# Altium schematic sheet 2008_SablierElectronique_MosfetConnections.SchDoc
size A3; Author: Carlos Reyes Peña; Organization: ETML-ES; Address1: Avenue Recordon 1; Address2: 1004 Lausanne; Address3: Switzerland; Revision: 1; SheetNumber: 3; SheetTotal: 4; Version: A
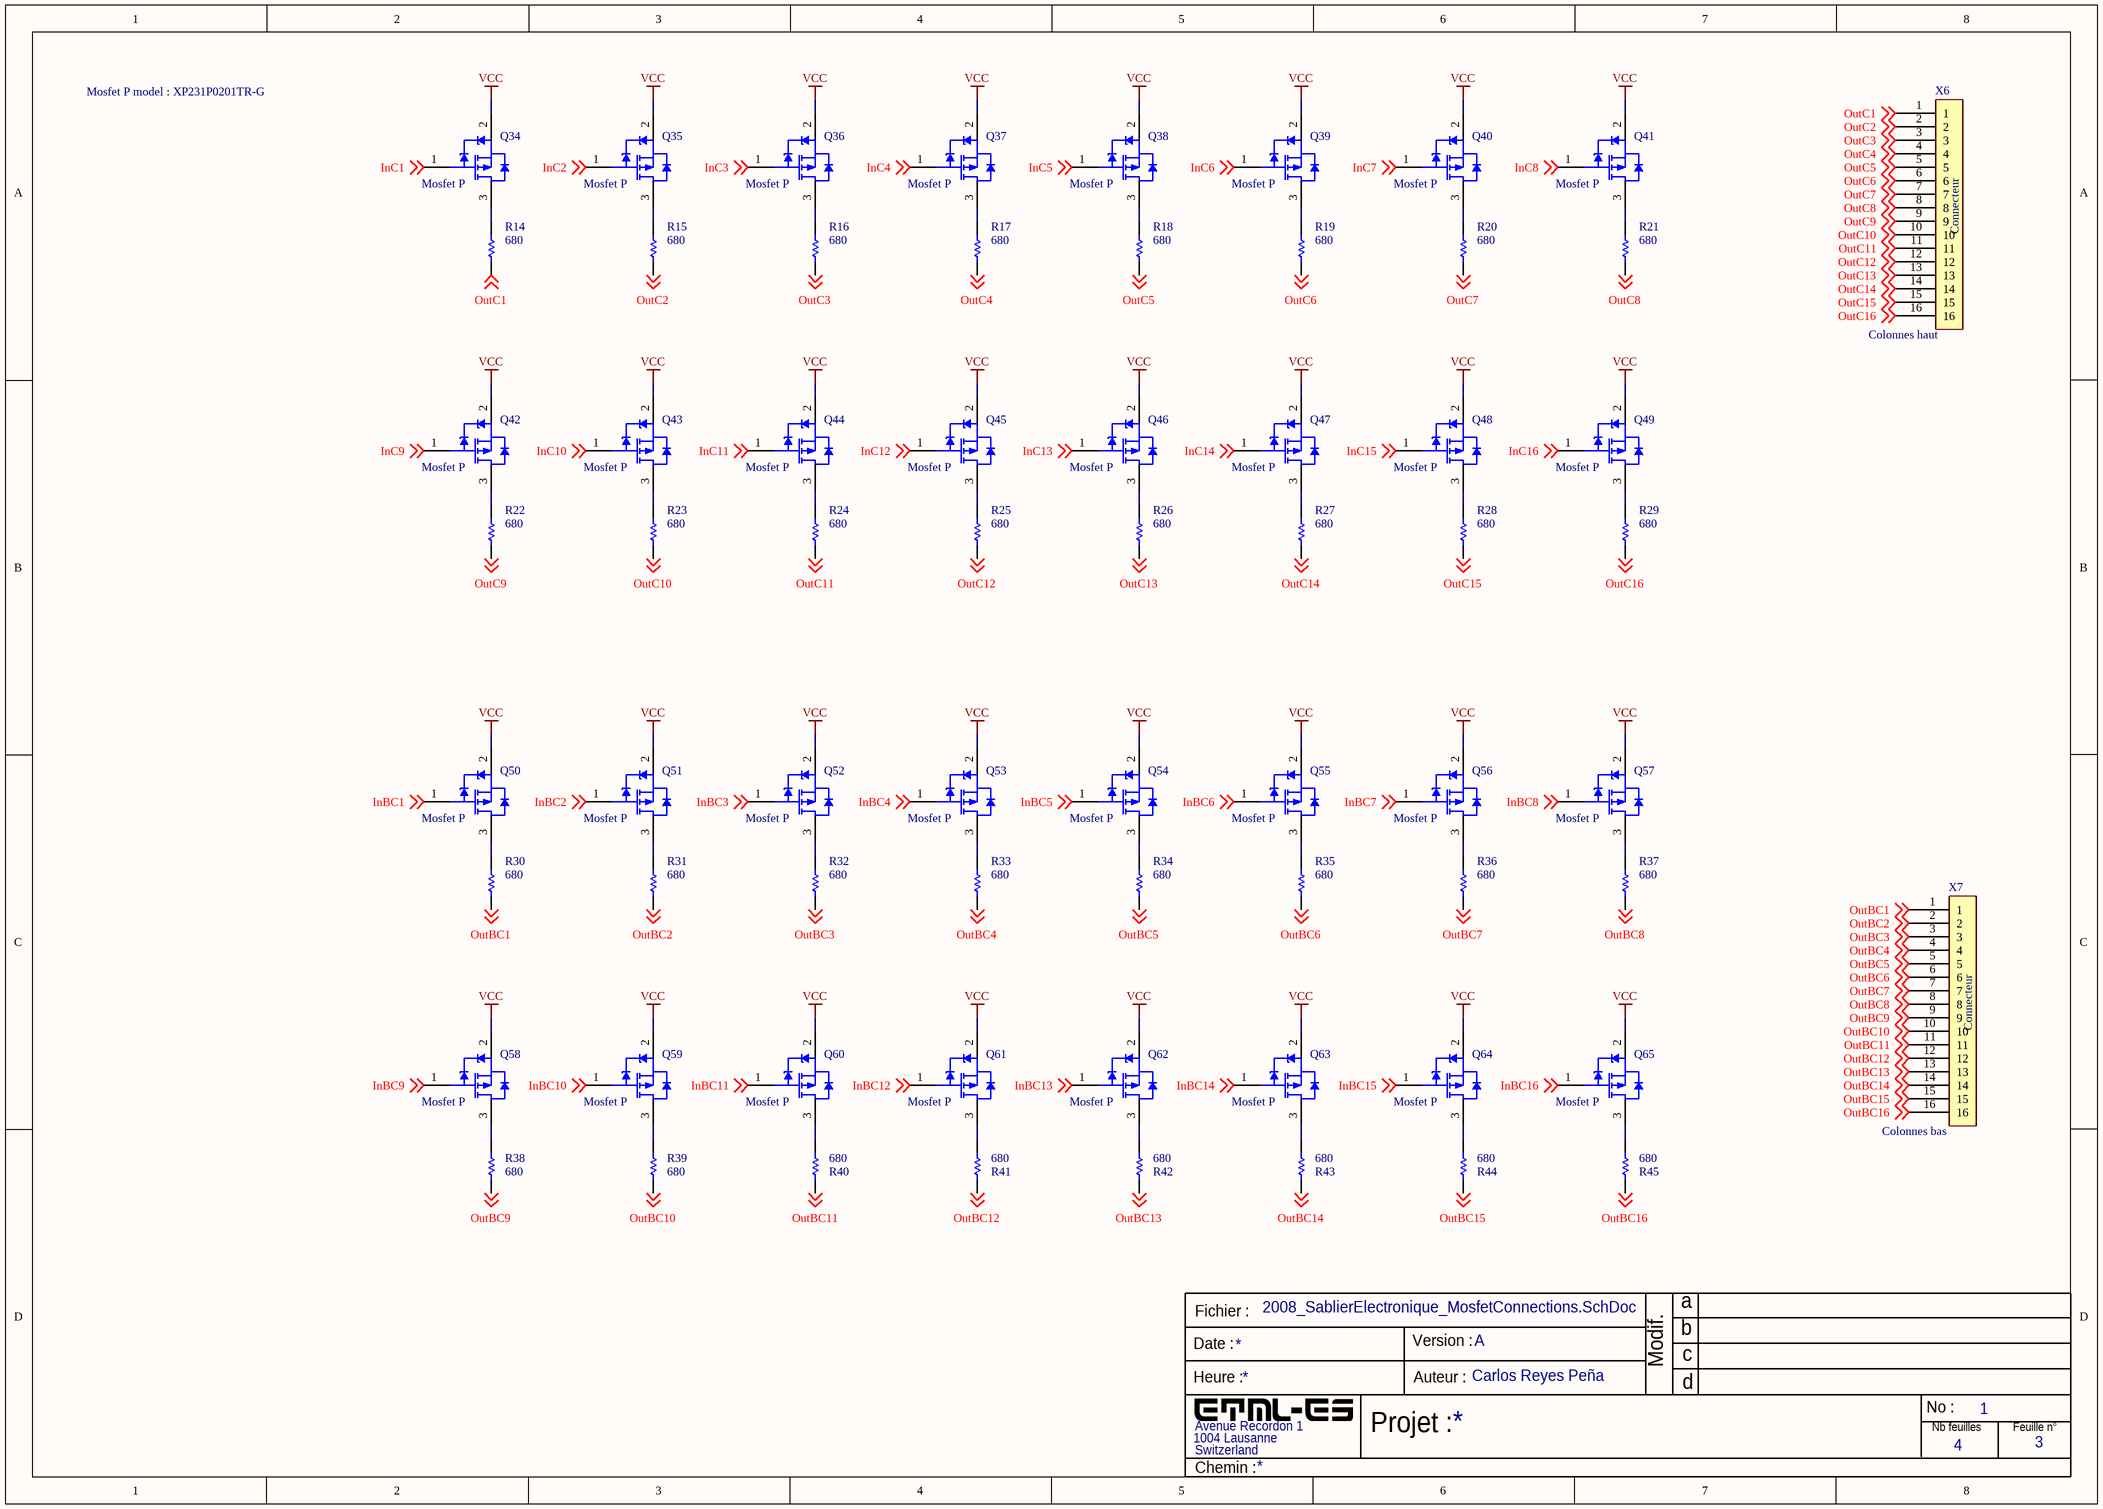
[diagram p0: 2008_SablierElectronique_MosfetConnections.SchDoc]

## Parts
Q34  Mosfet P  [FAIR-SOT23-3_V]
Q35  Mosfet P  [FAIR-SOT23-3_V]
Q36  Mosfet P  [FAIR-SOT23-3_V]
Q37  Mosfet P  [FAIR-SOT23-3_V]
Q38  Mosfet P  [FAIR-SOT23-3_V]
Q39  Mosfet P  [FAIR-SOT23-3_V]
Q40  Mosfet P  [FAIR-SOT23-3_V]
Q41  Mosfet P  [FAIR-SOT23-3_V]
Q42  Mosfet P  [FAIR-SOT23-3_V]
Q43  Mosfet P  [FAIR-SOT23-3_V]
Q44  Mosfet P  [FAIR-SOT23-3_V]
Q45  Mosfet P  [FAIR-SOT23-3_V]
Q46  Mosfet P  [FAIR-SOT23-3_V]
Q47  Mosfet P  [FAIR-SOT23-3_V]
Q48  Mosfet P  [FAIR-SOT23-3_V]
Q49  Mosfet P  [FAIR-SOT23-3_V]
Q50  Mosfet P  [FAIR-SOT23-3_V]
Q51  Mosfet P  [FAIR-SOT23-3_V]
Q52  Mosfet P  [FAIR-SOT23-3_V]
Q53  Mosfet P  [FAIR-SOT23-3_V]
Q54  Mosfet P  [FAIR-SOT23-3_V]
Q55  Mosfet P  [FAIR-SOT23-3_V]
Q56  Mosfet P  [FAIR-SOT23-3_V]
Q57  Mosfet P  [FAIR-SOT23-3_V]
Q58  Mosfet P  [FAIR-SOT23-3_V]
Q59  Mosfet P  [FAIR-SOT23-3_V]
Q60  Mosfet P  [FAIR-SOT23-3_V]
Q61  Mosfet P  [FAIR-SOT23-3_V]
Q62  Mosfet P  [FAIR-SOT23-3_V]
Q63  Mosfet P  [FAIR-SOT23-3_V]
Q64  Mosfet P  [FAIR-SOT23-3_V]
Q65  Mosfet P  [FAIR-SOT23-3_V]
R14  680  [RESC0805(2012)_L]
R15  680  [RESC0805(2012)_L]
R16  680  [RESC0805(2012)_L]
R17  680  [RESC0805(2012)_L]
R18  680  [RESC0805(2012)_L]
R19  680  [RESC0805(2012)_L]
R20  680  [RESC0805(2012)_L]
R21  680  [RESC0805(2012)_L]
R22  680  [RESC0805(2012)_L]
R23  680  [RESC0805(2012)_L]
R24  680  [RESC0805(2012)_L]
R25  680  [RESC0805(2012)_L]
R26  680  [RESC0805(2012)_L]
R27  680  [RESC0805(2012)_L]
R28  680  [RESC0805(2012)_L]
R29  680  [RESC0805(2012)_L]
R30  680  [RESC0805(2012)_L]
R31  680  [RESC0805(2012)_L]
R32  680  [RESC0805(2012)_L]
R33  680  [RESC0805(2012)_L]
R34  680  [RESC0805(2012)_L]
R35  680  [RESC0805(2012)_L]
R36  680  [RESC0805(2012)_L]
R37  680  [RESC0805(2012)_L]
R38  680  [RESC0805(2012)_L]
R39  680  [RESC0805(2012)_L]
R40  680  [RESC0805(2012)_L]
R41  680  [RESC0805(2012)_L]
R42  680  [RESC0805(2012)_L]
R43  680  [RESC0805(2012)_L]
R44  680  [RESC0805(2012)_L]
R45  680  [RESC0805(2012)_L]
X6  Colonnes haut  [CON8x8(edited)]
X7  Colonnes bas  [CON8x8(edited)]

## Nets
VCC: Q34.2(S) Q35.2(S) Q36.2(S) Q37.2(S) Q38.2(S) Q39.2(S) Q40.2(S) Q41.2(S) Q42.2(S) Q43.2(S) Q44.2(S) Q45.2(S) Q46.2(S) Q47.2(S) Q48.2(S) Q49.2(S) Q50.2(S) Q51.2(S) Q52.2(S) Q53.2(S) Q54.2(S) Q55.2(S) Q56.2(S) Q57.2(S) Q58.2(S) Q59.2(S) Q60.2(S) Q61.2(S) Q62.2(S) Q63.2(S) Q64.2(S) Q65.2(S)
InBC1: Q50.1(G) ; off-sheet InBC1
InBC2: Q51.1(G) ; off-sheet InBC2
InBC3: Q52.1(G) ; off-sheet InBC3
InBC4: Q53.1(G) ; off-sheet InBC4
InBC5: Q54.1(G) ; off-sheet InBC5
InBC6: Q55.1(G) ; off-sheet InBC6
InBC7: Q56.1(G) ; off-sheet InBC7
InBC8: Q57.1(G) ; off-sheet InBC8
InBC9: Q58.1(G) ; off-sheet InBC9
InBC10: Q59.1(G) ; off-sheet InBC10
InBC11: Q60.1(G) ; off-sheet InBC11
InBC12: Q61.1(G) ; off-sheet InBC12
InBC13: Q62.1(G) ; off-sheet InBC13
InBC14: Q63.1(G) ; off-sheet InBC14
InBC15: Q64.1(G) ; off-sheet InBC15
InBC16: Q65.1(G) ; off-sheet InBC16
InC1: Q34.1(G) ; off-sheet InC1
InC2: Q35.1(G) ; off-sheet InC2
InC3: Q36.1(G) ; off-sheet InC3
InC4: Q37.1(G) ; off-sheet InC4
InC5: Q38.1(G) ; off-sheet InC5
InC6: Q39.1(G) ; off-sheet InC6
InC7: Q40.1(G) ; off-sheet InC7
InC8: Q41.1(G) ; off-sheet InC8
InC9: Q42.1(G) ; off-sheet InC9
InC10: Q43.1(G) ; off-sheet InC10
InC11: Q44.1(G) ; off-sheet InC11
InC12: Q45.1(G) ; off-sheet InC12
InC13: Q46.1(G) ; off-sheet InC13
InC14: Q47.1(G) ; off-sheet InC14
InC15: Q48.1(G) ; off-sheet InC15
InC16: Q49.1(G) ; off-sheet InC16
OutBC1: R30.1 X7.1 ; off-sheet OutBC1
OutBC2: R31.1 X7.2 ; off-sheet OutBC2
OutBC3: R32.1 X7.3 ; off-sheet OutBC3
OutBC4: R33.1 X7.4 ; off-sheet OutBC4
OutBC5: R34.1 X7.5 ; off-sheet OutBC5
OutBC6: R35.1 X7.6 ; off-sheet OutBC6
OutBC7: R36.1 X7.7 ; off-sheet OutBC7
OutBC8: R37.1 X7.8 ; off-sheet OutBC8
OutBC9: R38.1 X7.9 ; off-sheet OutBC9
OutBC10: R39.1 X7.10 ; off-sheet OutBC10
OutBC11: R40.1 X7.11 ; off-sheet OutBC11
OutBC12: R41.1 X7.12 ; off-sheet OutBC12
OutBC13: R42.1 X7.13 ; off-sheet OutBC13
OutBC14: R43.1 X7.14 ; off-sheet OutBC14
OutBC15: R44.1 X7.15 ; off-sheet OutBC15
OutBC16: R45.1 X7.16 ; off-sheet OutBC16
OutC1: R14.1 X6.1 ; off-sheet OutC1
OutC2: R15.1 X6.2 ; off-sheet OutC2
OutC3: R16.1 X6.3 ; off-sheet OutC3
OutC4: R17.1 X6.4 ; off-sheet OutC4
OutC5: R18.1 X6.5 ; off-sheet OutC5
OutC6: R19.1 X6.6 ; off-sheet OutC6
OutC7: R20.1 X6.7 ; off-sheet OutC7
OutC8: R21.1 X6.8 ; off-sheet OutC8
OutC9: R22.1 X6.9 ; off-sheet OutC9
OutC10: R23.1 X6.10 ; off-sheet OutC10
OutC11: R24.1 X6.11 ; off-sheet OutC11
OutC12: R25.1 X6.12 ; off-sheet OutC12
OutC13: R26.1 X6.13 ; off-sheet OutC13
OutC14: R27.1 X6.14 ; off-sheet OutC14
OutC15: R28.1 X6.15 ; off-sheet OutC15
OutC16: R29.1 X6.16 ; off-sheet OutC16
NetQ34_3: Q34.3(D) R14.2
NetQ35_3: Q35.3(D) R15.2
NetQ36_3: Q36.3(D) R16.2
NetQ37_3: Q37.3(D) R17.2
NetQ38_3: Q38.3(D) R18.2
NetQ39_3: Q39.3(D) R19.2
NetQ40_3: Q40.3(D) R20.2
NetQ41_3: Q41.3(D) R21.2
NetQ42_3: Q42.3(D) R22.2
NetQ43_3: Q43.3(D) R23.2
NetQ44_3: Q44.3(D) R24.2
NetQ45_3: Q45.3(D) R25.2
NetQ46_3: Q46.3(D) R26.2
NetQ47_3: Q47.3(D) R27.2
NetQ48_3: Q48.3(D) R28.2
NetQ49_3: Q49.3(D) R29.2
NetQ50_3: Q50.3(D) R30.2
NetQ51_3: Q51.3(D) R31.2
NetQ52_3: Q52.3(D) R32.2
NetQ53_3: Q53.3(D) R33.2
NetQ54_3: Q54.3(D) R34.2
NetQ55_3: Q55.3(D) R35.2
NetQ56_3: Q56.3(D) R36.2
NetQ57_3: Q57.3(D) R37.2
NetQ58_3: Q58.3(D) R38.2
NetQ59_3: Q59.3(D) R39.2
NetQ60_3: Q60.3(D) R40.2
NetQ61_3: Q61.3(D) R41.2
NetQ62_3: Q62.3(D) R42.2
NetQ63_3: Q63.3(D) R43.2
NetQ64_3: Q64.3(D) R44.2
NetQ65_3: Q65.3(D) R45.2

## Notes on the sheet
- Mosfet P model : XP231P0201TR-G
- Fichier :
- a
- Date :
- Heure :
- Version :
- Auteur :
- Modif.
- b
- c
- d
- Projet :
- No :
- Nb feuilles
- Feuille n°
- Chemin :
- (in symbol Mâle DIN 8 x 8) Connecteur

## Library data of the parts
R14-R45 = RES
X6 X7 = Mâle DIN 8 x 8